# EAGLE design Calc13Digit034 (EAGLE 7.7.0)
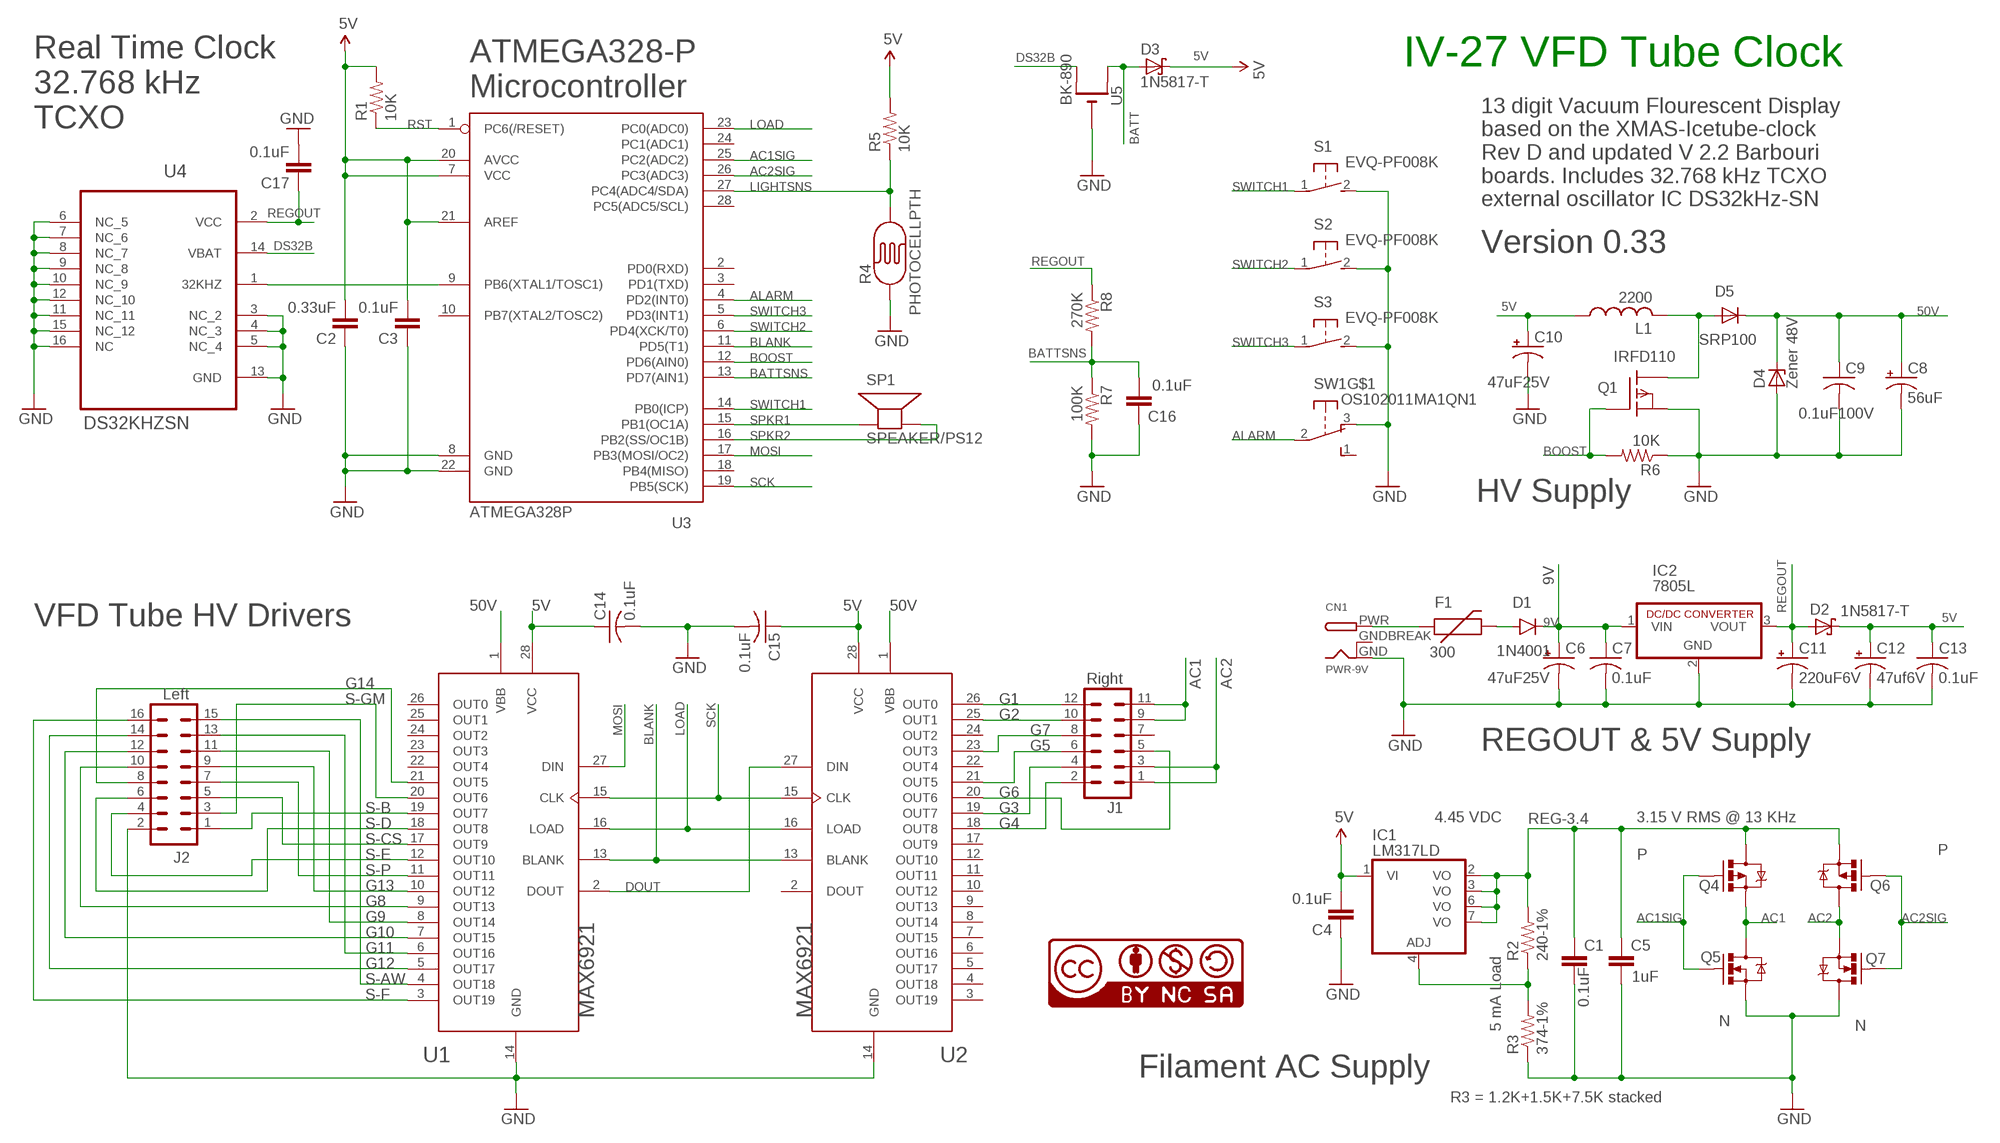
[diagram p0: schematic, sheet 1]

## Parts
C1  0.1uF  1.0UF-16V-10%(0603)  [0603-CAP]
C2  0.33uF  1.0UF-16V-10%(0603)  [0603-CAP]
C3  0.1uF  1.0UF-16V-10%(0603)  [0603-CAP]
C4  0.1uF  1.0UF-16V-10%(0603)  [0603-CAP]
C5  1uF  1.0UF-16V-10%(0603)  [0603-CAP]
C6  47uF25V  CPOL-USE2.5-7  [E2,5-7]
C7  0.1uF  C-USC0805  [C0805]
C8  56uF  CPOL-USE3.5-8  [E3,5-8]
C9  0.1uF100V  C-US025-024X044  [C025-024X044]
C10  47uF25V  CPOL-USE2.5-7  [E2,5-7]
C11  220uF6V  CPOL-USE2.5-7  [E2,5-7]
C12  47uf6V  CPOL-USE2.5-7  [E2,5-7]
C13  0.1uF  C-US025-024X044  [C025-024X044]
C14  0.1uF  C-US025-024X044  [C025-024X044]
C15  0.1uF  C-US025-024X044  [C025-024X044]
C16  0.1uF  1.0UF-16V-10%(0603)  [0603-CAP]
C17  0.1uF  1.0UF-16V-10%(0603)  [0603-CAP]
CN1  PWR-9V  DCBARRELPTH  [DCJACK_2MM_PTH]
D1  1N4001  DIODEPTH  [DIODE-1N4001]
D2  1N5817-T  [DO41-7.6]
D3  1N5817-T  [DO41-7.6]
D4  Zener 48V  ZENER-DIODEZD-10  [ZDIO-10]
D5  SRP100  [DO41-10]
F1  300  PTCPTH  [PTC]
IC1  LM317LD  [SO08]
IC2  7805L  R-78C5.0-1.0  [SIP3]
J1  Right  M06X2PTH_FEMALE  [2X6]
J2  Left  M08X2  [2X8]
L1  2200  L  [6000]
Q1  IRFD110  IRFD9210  [DIL04]
Q4  P  MOSFET-PCHANNEL  [SOT23-3]
Q5  N  MOSFET-NCHANNELBSS123LT1G  [SOT23-3]
Q6  P  MOSFET-PCHANNEL  [SOT23-3]
Q7  N  MOSFET-NCHANNELBSS123LT1G  [SOT23-3]
R1  10K  10KOHM-1/10W-1%(0603)0603  [0603-RES]
R2  240-1%  0.3OHM-1/8W-1%(0805)  [0805]
R3  374-1%  0.3OHM-1/8W-1%(0805)  [0805]
R4  PHOTOCELLPTH  [PHOTOCELL]
R5  10K  10KOHM-1/10W-1%(0603)0603  [0603-RES]
R6  10K  10KOHM-1/10W-1%(0603)0603  [0603-RES]
R7  100K  10KOHM-1/10W-1%(0603)0603  [0603-RES]
R8  270K  10KOHM-1/10W-1%(0603)0603  [0603-RES]
S1  EVQ-PF008K  31-XX  [B3F-31XX]
S2  EVQ-PF008K  31-XX  [B3F-31XX]
S3  EVQ-PF008K  31-XX  [B3F-31XX]
SP1  SPEAKER/PS12  [PS12]
SW1  OS102011MA1QN1  OS102011MA1Q  [OS102011MA1Q]
U1  MAX6921  [PLCC-S28]
U2  MAX6921  [PLCC-S28]
U3  ATMEGA328P  ATMEGA328P_PDIP  [DIL28-3]
U4  DS32KHZSN  [SOIC127P1034X267-16N]
U5  BK-890  CR1220THM  [CR1220-THM]
U$2  CC-NC-BCSMALL  [CC-NC-BY_SMALL]

## Nets
5V: C2.2 C3.2 C4.2 C10.+ C12.+ C13.1 C14.1 C15.1 D2.C D3.C IC1.1(VI) L1.1 R1.2 R5.2 U1.28(VCC) U2.28(VCC) U3.7(VCC) U3.20(AVCC) U3.21(AREF)
9V: C6.+ C7.1 D1.C IC2.1(VIN)
32KHZ: U3.9(PB6(XTAL1/TOSC1)) U4.1(32KHZ)
50V: C8.+ C9.1 D4.C D5.C U1.1(VBB) U2.1(VBB)
AC1: J1.9 J1.11 Q4.2(S) Q5.3(D)
AC1SIG: Q4.1(G) Q5.1(G) U3.25(PC2(ADC2))
AC2: J1.1 J1.3 Q6.3(D) Q7.2(S)
AC2SIG: Q6.1(G) Q7.1(G) U3.26(PC3(ADC3))
ALARM: SW1.2(P) U3.4(PD2(INT0))
BATT: D3.A U5.+1(+)
BATTSNS: C16.2 R7.1 R8.2 U3.13(PD7(AIN1))
BLANK: U1.13(BLANK) U2.13(BLANK) U3.11(PD5(T1))
BOOST: Q1.1(G) R6.2 U3.12(PD6(AIN0))
DOUT: U1.2(DOUT) U2.27(DIN)
DS32B: U4.14(VBAT) U5.+2(+1)
F9V: D1.A F1.P$2
G1: J1.12 U2.26(OUT0)
G2: J1.10 U2.25(OUT1)
G3: J1.4 U2.19(OUT7)
G4: J1.2 U2.18(OUT8)
G5: J1.6 U2.21(OUT5)
G6: J1.5 U2.20(OUT6)
G7: J1.8 U2.23(OUT3)
G8: J2.10 U1.9(OUT13)
G9: J2.11 U1.8(OUT14)
G10: J2.12 U1.7(OUT15)
G11: J2.13 U1.6(OUT16)
G12: J2.14 U1.5(OUT17)
G13: J2.9 U1.10(OUT12)
G14: J2.8 U1.21(OUT5)
GND: C1.1 C2.1 C3.1 C4.1 C5.1 C6.- C7.2 C8.- C9.2 C10.- C11.- C12.- C13.2 C14.2 C15.2 C16.1 C17.2 CN1.GND D4.A IC2.2(GND) J2.2 Q1.2(S) Q5.2(S) Q7.3(D) R3.1 R4.1 R6.1 R7.2 S1.2(S) S2.2(S) S3.2(S) SW1.3(O) U1.14(GND) U2.14(GND) U3.8(GND) U3.22(GND) U4.3(NC_2) U4.4(NC_3) U4.5(NC_4) U4.6(NC_5) U4.7(NC_6) U4.8(NC_7) U4.9(NC_8) U4.10(NC_9) U4.11(NC_11) U4.12(NC_10) U4.13(GND) U4.15(NC_12) U4.16(NC) U5.-
LIGHTSNS: R4.2 R5.1 U3.27(PC4(ADC4/SDA))
LOAD: U1.16(LOAD) U2.16(LOAD) U3.23(PC0(ADC0))
MOSI: U1.27(DIN) U3.17(PB3(MOSI/OC2))
N$25: D5.A L1.2 Q1.3(D) Q1.4(D)
N$28: IC1.4(ADJ) R2.1 R3.2
PWR: CN1.PWR F1.P$1
REG-3.4: C1.2 C5.2 IC1.2(VO) IC1.3(VO) IC1.6(VO) IC1.7(VO) Q4.3(D) Q6.2(S) R2.2
REGOUT: C11.+ C17.1 D2.A IC2.3(VOUT) R8.1 U4.2(VCC)
RST: R1.1 U3.1(PC6(/RESET))
S-AW: J2.15 U1.4(OUT18)
S-B: J2.1 U1.19(OUT7)
S-CS: J2.5 U1.17(OUT9)
S-D: J2.6 U1.18(OUT8)
S-E: J2.4 U1.12(OUT10)
S-F: J2.16 U1.3(OUT19)
S-GM: J2.3 U1.20(OUT6)
S-P: J2.7 U1.11(OUT11)
SCK: U1.15(CLK) U2.15(CLK) U3.19(PB5(SCK))
SPKR1: SP1.P$1(+) U3.15(PB1(OC1A))
SPKR2: SP1.P$2(-) U3.16(PB2(SS/OC1B))
SWITCH1: S1.1(P) U3.14(PB0(ICP))
SWITCH2: S2.1(P) U3.6(PD4(XCK/T0))
SWITCH3: S3.1(P) U3.5(PD3(INT1))
Unconnected: J1.7 SW1.1(S) SW1.MT1(MT) SW1.MT2(MT) U1.22(OUT4) U1.23(OUT3) U1.24(OUT2) U1.25(OUT1) U1.26(OUT0) U2.2(DOUT) U2.3(OUT19) U2.4(OUT18) U2.5(OUT17) U2.6(OUT16) U2.7(OUT15) U2.8(OUT14) U2.9(OUT13) U2.10(OUT12) U2.11(OUT11) U2.12(OUT10) U2.17(OUT9) U2.22(OUT4) U2.24(OUT2) U3.2(PD0(RXD)) U3.3(PD1(TXD)) U3.10(PB7(XTAL2/TOSC2)) U3.18(PB4(MISO)) U3.24(PC1(ADC1)) U3.28(PC5(ADC5/SCL))

## Notes on the sheet
- IV-27 VFD Tube Clock
- ATMEGA328-P
  Microcontroller
- 13 digit Vacuum Flourescent Display
  based on the XMAS-Icetube-clock
  Rev D and updated V 2.2 Barbouri
  boards. Includes 32.768 kHz TCXO
  external oscillator IC DS32kHz-SN
- Real Time Clock
  32.768 kHz
  TCXO
- Version 0.33
- HV Supply
- VFD Tube HV Drivers
- REGOUT & 5V Supply
- 4.45 VDC | 3.15 V RMS @ 13 KHz
- 5 mA Load
- Filament AC Supply
- R3 = 1.2K+1.5K+7.5K stacked

## Power pins joined to a net without a drawn wire
GNDBREAK: CN1.GNDBREAK

## Library data of the parts
C1-C5 C16 C17 = SparkFun-Capacitors:1.0UF-16V-10%(0603): CAP-00868; PROD_ID: CAP-00868; VALUE: 1.0uF
C6 C8 C10-C12 = resistor:CPOL-US: POLARIZED CAPACITOR, American symbol
C7 C9 C13-C15 = resistor:C-US: CAPACITOR, American symbol
CN1 = adafruit:DCBARREL: 2.0mm DC Barrel Jack DCJACK_2MM_PTH - Through Hole Jack (4UConnector: 05537)
D1 = SparkFun-DiscreteSemi:DIODE: Diode These are standard reverse protection diodes and small signal diodes. SMA package can handle up to about 1A. SOD-323 can handle about 200mA. What the SOD-323 package when ordering, there are some mfgs out there that are 5-pin packages.
D2 D3 = diode:1N581*: 1.0A SCHOTTKY BARRIER RECTIFIER Source: http://www.diodes.com/datasheets/ds23001.pdf
D4 = diode:ZENER-DIODE: Z-Diode
D5 = diode:SRP100: DIODE
F1 = SparkFun-PowerIC:PTC: Resettable Fuse PTC Resettable Fuse. Spark Fun Electronics SKU : COM-08357
IC1 = linear:LM317LD: LOW CURRENT 1.2 TO 37V ADJUSTABLE VOLTAGE REGULATOR Source: http://pdf.alldatasheet.com
IC2 = dc-dc-converter:R-78C*-1.0: INNOLINE DC/DC-Converter 1.0 AMP SIP3 Single Output Source: Data sheet <http://www.mikrocontroller.net/attachment/150645/157764-da-01-en-DC_DC_WANDLER_R_78C5_0_1_0.pdf>
J1 = SparkFun-Connectors:M06X2; PROD_ID: CONN-12423; VALUE: 2X6 FEMALE
J2 = SparkFun-Connectors:M08X2: .1" headers, two rows of 8 each
L1 = adafruit:L
Q1 = transistor-fet:IRFD9210: P-Channel Enhancement MOSFET
Q4 Q6 = SparkFun-DiscreteSemi:MOSFET-PCHANNEL: Generic PMOSFET IRLML2244 - TRANS-11153 (SOT-23 -20V -4.3A) (1.Gate 2.Source 3.Drain) FQP27P06 - COM-10349 <http://www.sparkfun.com/products/10349> (TO-220 -60V -27A) (1.Gate 2.Source 3.Drain); PROD_ID: TRANS-08285
Q5 Q7 = SparkFun-DiscreteSemi:MOSFET-NCHANNEL: Common NMOSFET Parts MFG P/N Store ID Prod ID FDD8780 TRANS-09984 SI7820DN TRANS-11055 FDS6630A IC-08089 2N7002PW TRANS-11151 FQP30N06L COM-10213 TRANS-10060 BSS123LT1G TRANS-08345 BSS138 TRANS-00830 BS170 2N7000; PROD_ID: TRANS-08345
R1 R5 R6 = SparkFun-Resistors:10KOHM-1/10W-1%(0603): RES-00824; PROD_ID: RES-00824
R2 R3 = SparkFun-Resistors:0.3OHM-1/8W-1%(0805): RES-11622; PROD_ID: RES-11622; VALUE: 0.3
R4 = SparkFun-Sensors:PHOTOCELL: CdS photoresistor. This is a low cost way to detect light levels. Resistance decreases with more incoming light. SparkFun SKU: SEN-09088
R7 R8 = SparkFun-Resistors:10KOHM-1/10W-1%(0603): RES-00824; PROD_ID: RES-00824; VALUE: 10K
S1-S3 = switch-omron:31-XX: OMRON SWITCH; MPN: B3F-3100; OC_FARNELL: 959704; OC_NEWARK: 36M3582
SP1 = adafruit:SPEAKER: SPEAKER Source: Buerklin Added PS12 (for part # PS1240 piezo) http://www.ladyada.net/library/pcb/eaglelibrary.html
SW1 = adafruit:OS102011MA1Q: OS10201MA1Q through-hole right angle switch http://www.ladyada.net/library/eagle
U1 U2 = Caddock:MAX6921: MAX6921 76V VFD driver in TSSOP and PLCC. Can be cascaded, talk to it via SPI
U3 = SparkFun-DigitalIC:ATMEGA328P_PDIP: uC used in the Arduino 32kb flash, 1k EEPROM, 2k SRAM This is the through-hole version of this chip.
U4 = Maxim_By_element14_Batch_1:DS32KHZSN: 32.768kHz Temperature-Compensated Crystal Oscillator; MPN: DS32KHZSN#; OC_FARNELL: -; OC_NEWARK: 68K3402; PACKAGE: SOIC-16; SUPPLIER: Maxim
U5 = adafruit:CR1220: CR1216/CR1220/CR1225 12mm 3V lithium coin cell Great for battery packup. Both SMT and THM holders. Note the THM package has the ground pads on both sides of the PCB so that the masks are the same - this reduces the cost
U$2 = cc-by-nc-sa:CC-NC-BC: All hardware is licensed under the Creative Commons Attribution-Noncommercial-Share Alike 2.5 Switzerland License. To view a copy of this license, visit http://creativecommons.org/licenses/by-nc-sa/2.5/ch/ or send a letter to Creative Commons, 171 Second Street, Suite 300, San Francisco, California, 94105, USA.

## Board
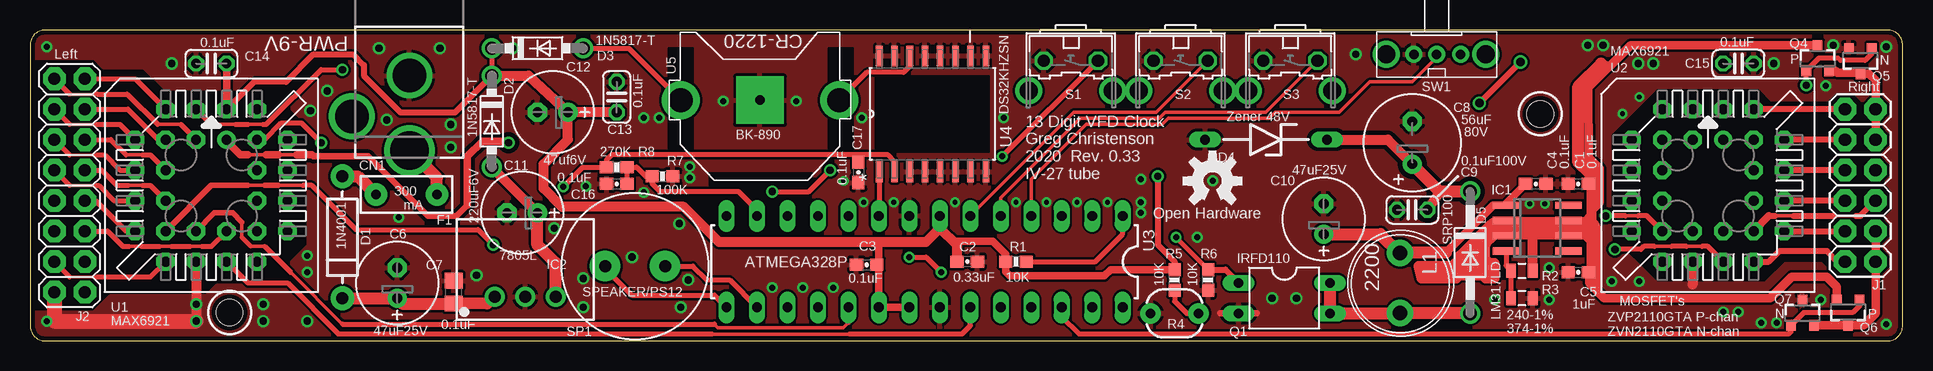
[diagram p1: board, top side]
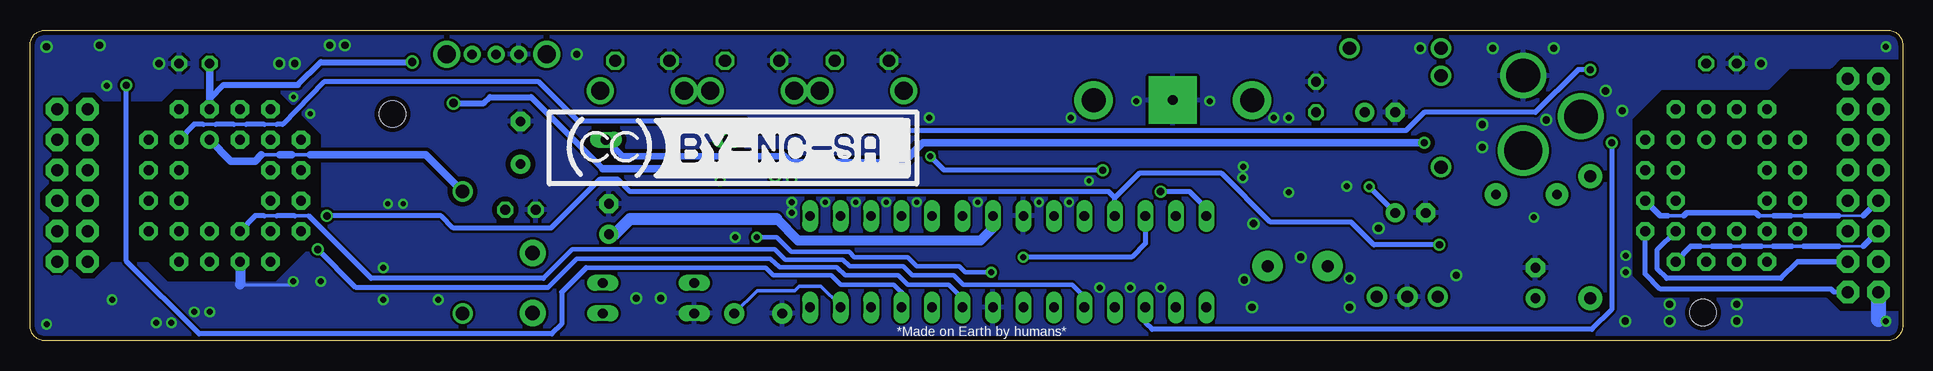
[diagram p2: board, bottom side, seen from below]

Size 156.06 x 25.91 mm. Coordinates in mm from the lower left corner, seen from the top.
Outline: 1.27,0 154.79,0 arc90 156.06,1.27 156.06,24.64 arc90 154.79,25.91 1.27,25.91 arc90 0,24.64 0,1.27 arc90 1.27,0
Copper layers (1*16): Top 0.035mm / dielectric 1.5mm / Bottom 0.035mm
Design rules "default *": minimum track width 8mil, minimum drill 9mil, track to track 8mil, track to pad 8mil, pad to pad 8mil, via to via 8mil, smd to smd 6mil, copper to edge 15mil, drill to drill 9mil, minimum pad ring 10mil, minimum via ring 8mil, stop-mask expansion 4mil, vias tented up to drill 24mil, thermal gap 10mil
Holes 2.2 mm at 125.86,18.92 16.64,2.36
tRestrict: area 70.5,15.7 to 79.9,22; area 119.6,12.1 to 120.4,12.8; area 116.2,10.7 to 116.7,11.2; area 114.8,14.4 to 115.6,15.1; area 39.2,15.9 to 40.5,17.1; 15 lines
bRestrict: area 119.6,12.1 to 120.4,12.8; area 116.2,10.7 to 116.7,11.2; area 114.8,14.3 to 115.6,15.1; area 39.2,15.9 to 40.5,17.1; 10 lines

### Footprints (pad centres in the part's own frame; a part is rotated, then mirrored left to right if it is on the bottom)
0603-CAP = smd 1.1 x 1: 1 -0.85,0; 2 0.85,0
E2,5-7 = drill 0.813 pad 1.6: + -1.27,0 | drill 0.813 pad 1.6 octagon: - 1.27,0
C0805 = smd 1.3 x 1.5: 1 -0.95,0; 2 0.95,0
E3,5-8 = drill 0.813 pad 1.6: + -1.778,0 | drill 0.813 pad 1.6 octagon: - 1.778,0
C025-024X044 = drill 0.813 octagon: 1 -1.27,0; 2 1.27,0
DCJACK_2MM_PTH = drill 2.8: GND 0,7.35; GNDBREAK 4.8,10.75 | drill 3.2: PWR 0,13.6
DIODE-1N4001 = drill 1 pad 1.981: A -5.08,0; C 5.08,0
DO41-7.6 = drill 1.1 pad 1.7: A 3.81,0; C -3.81,0
ZDIO-10 = drill 0.813 long: A 5.08,0; C -5.08,0
DO41-10 = drill 1.118: A 5.08,0; C -5.08,0
PTC = drill 0.8 pad 1.88: P$1 -2.54,0; P$2 2.54,0
SO08 = smd 0.6 x 2.2: 1 -1.905,-2.6; 2 -0.635,-2.6; 3 0.635,-2.6; 4 1.905,-2.6; 5 1.905,2.6; 6 0.635,2.6; 7 -0.635,2.6; 8 -1.905,2.6
SIP3 = drill 1 pad 1.676: 1 -2.54,0; 2 0,0; 3 2.54,0
2X6 = drill 1.016 pad 1.88 octagon: 1 0,0; 2 0,2.54; 3 2.54,0; 4 2.54,2.54; 5 5.08,0; 6 5.08,2.54; 7 7.62,0; 8 7.62,2.54; 9 10.16,0; 10 10.16,2.54; 11 12.7,0; 12 12.7,2.54
2X8 = drill 1.016 pad 1.88 octagon: 1 0,0; 2 0,2.54; 3 2.54,0; 4 2.54,2.54; 5 5.08,0; 6 5.08,2.54; 7 7.62,0; 8 7.62,2.54; 9 10.16,0; 10 10.16,2.54; 11 12.7,0; 12 12.7,2.54; 13 15.24,0; 14 15.24,2.54; 15 17.78,0; 16 17.78,2.54
6000 = drill 1.2 pad 2.184: 1 -2.5,0; 2 2.5,0
DIL04 = drill 0.813 long: 1 -1.27,-3.81; 2 1.27,-3.81; 3 1.27,3.81; 4 -1.27,3.81
SOT23-3 = smd 0.8 x 0.9: 1 -0.95,-1; 2 0.95,-1; 3 0,1.1
0603-RES = smd 1.1 x 1: 1 -0.85,0; 2 0.85,0
0805 = smd 0.8 x 1.2: 1 -0.9,0; 2 0.9,0
PHOTOCELL = drill 0.8 pad 1.676: 1 -2,0; 2 2,0
B3F-31XX = drill 1.016 octagon: 1 -2.261,-1.245; 2 2.261,-1.245 | drill 1.499 pad 2.159: 3 -3.505,1.245; 4 3.505,1.245
PS12 = drill 1 pad 2.54: P$1 -2.5,0; P$2 2.5,0
OS102011MA1Q = drill 0.8 pad 1.422: 1 -2,0; 2 0,0; 3 1.9,0 | drill 1.5 pad 2.184: MT1 -4.1,0; MT2 4.2,0
PLCC-S28 = drill 0.813 pad 1.524: 1 1.27,3.81 | drill 0.813 pad 1.524 octagon: 2 -1.27,6.35; 3 -1.27,3.81; 4 -3.81,6.35; 5 -6.35,3.81; 6 -3.81,3.81; 7 -6.35,1.27; 8 -3.81,1.27; 9 -6.35,-1.27; 10 -3.81,-1.27; 11 -6.35,-3.81; 12 -3.81,-6.35; 13 -3.81,-3.81; 14 -1.27,-6.35; 15 -1.27,-3.81; 16 1.27,-6.35; 17 1.27,-3.81; 18 3.81,-6.35; 19 6.35,-3.81; 20 3.81,-3.81; 21 6.35,-1.27; 22 3.81,-1.27; 23 6.35,1.27; 24 3.81,1.27; 25 6.35,3.81; 26 3.81,6.35; 27 3.81,3.81; 28 1.27,6.35
DIL28-3 = drill 0.813 long: 1 -16.51,-3.81; 2 -13.97,-3.81; 3 -11.43,-3.81; 4 -8.89,-3.81; 5 -6.35,-3.81; 6 -3.81,-3.81; 7 -1.27,-3.81; 8 1.27,-3.81; 9 3.81,-3.81; 10 6.35,-3.81; 11 8.89,-3.81; 12 11.43,-3.81; 13 13.97,-3.81; 14 16.51,-3.81; 15 16.51,3.81; 16 13.97,3.81; 17 11.43,3.81; 18 8.89,3.81; 19 6.35,3.81; 20 3.81,3.81; 21 1.27,3.81; 22 -1.27,3.81; 23 -3.81,3.81; 24 -6.35,3.81; 25 -8.89,3.81; 26 -11.43,3.81; 27 -13.97,3.81; 28 -16.51,3.81
SOIC127P1034X267-16N = smd 1.727 x 0.559: 1 -4.826,4.445; 2 -4.826,3.175; 3 -4.826,1.905; 4 -4.826,0.635; 5 -4.826,-0.635; 6 -4.826,-1.905; 7 -4.826,-3.175; 8 -4.826,-4.445; 9 4.826,-4.445; 10 4.826,-3.175; 11 4.826,-1.905; 12 4.826,-0.635; 13 4.826,0.635; 14 4.826,1.905; 15 4.826,3.175; 16 4.826,4.445
CR1220-THM = drill 2 pad 3.175: +1 -6.604,0; +2 6.604,0 | drill 0.8 pad 3.962 square: - 0,0

### Placement (x,y rotation side)
C1  129.03,13.08 0 top
C2  78.11,6.6 180 top
C3  69.72,6.35 0 top
C4  125.48,13.08 180 top
C5  129.03,5.71 0 top
C6  30.61,4.83 90 top
C7  35.31,4.06 90 top
C8  115.19,16.51 90 top
C9  115.19,10.92 180 top
C10  107.82,10.16 90 top
C11  41.02,10.67 180 top
C12  43.56,19.05 180 top
C13  48.9,20.32 90 top
C14  15.11,23.11 180 top
C15  142.37,23.11 0 top
C16  48.9,13.08 0 top
C17  69.04,14.05 270 top
CN1  31.62,29.46 180 top
D1  26.04,8.64 270 top
D2  38.48,18.29 270 top
D3  42.29,24.38 0 top
D4  103,16.76 180 top
D5  120.02,7.37 270 top
F1  31.37,12.19 180 top
IC1  125.6,9.4 270 top
IC2  41.27,3.68 0 top
J1  153.8,6.6 90 top
J2  4.57,4.06 90 top
L1  114.17,4.83 270 top
Q1  104.52,3.56 270 top
Q4  148.97,23.52 0 top
Q5  152.53,23.37 180 top
Q6  151.51,2.41 180 top
Q7  147.7,2.31 0 top
R1  82.17,6.6 180 top
R2  124.33,5.84 0 top
R3  124.33,3.56 180 top
R4  95.38,2.29 0 top
R5  95.38,5.08 90 top
R6  98.17,5.08 90 top
R7  52.7,13.72 0 top
R8  48.9,14.48 0 top
S1  86.74,22.1 180 top
S2  95.89,22.1 180 top
S3  105.03,22.1 180 top
SP1  50.42,6.22 0 top
SW1  117.22,23.88 180 top
U1  15.11,12.95 0 top
U2  139.83,12.95 0 top
U3  74.55,6.6 180 top
U4  75.21,18.92 90 top
U5  60.83,20.07 0 top
U$1  [OSHW-LOGO-M]  98.55,13.34 0 top
U$2  112.78,13.08 0 bottom

### Tracks (layer width: path | path; a pad name or v marks a point on that pad's centre or on a via)
5V  (via drill 0.6, 0.7)
  Top 0.305: 121.92,11.3 IC1.1
  Top 0.406: D3.C D2.C | 76.99,8.31 77.25,7.96 | 95.36,5.92 R5.2
  Top 0.508: D2.C 35.43,19.05 30.86,19.05 27.81,22.1 27.81,22.99 26.92,23.88 23.62,23.88 21.34,21.59 18.67,21.59 U1.28 | v124.21,23.24 v120.78,19.81 | v93.98,13.72 93.98,8 95.38,6.6 R5.2
  Top 0.61: 70.74,6.01 U3.20 U3.21 | 70.74,6.01 C3.2 | 70.74,6.01 70.74,8.23 | 76.99,8.31 80.21,8.31 81.32,7.2 R1.2 81.32,5.75 81.66,5.41 89.53,5.41 90.04,5.92 95.36,5.92 | C14.1 U1.28 | IC1.1 123,11.43 C4.2
  Top 0.686: 121.92,11.3 117.98,7.37
  Top 0.813: U3.7 75.82,9.4 | 75.82,9.4 74.65,8.23 70.74,8.23 57.43,8.23 54.48,11.18 44.32,11.18 42.8,12.7 42.8,14.73 44.83,16.76 C12.+ | D2.C 41.53,22.1 C12.+ | C13.1 C12.+ | C2.2 77.25,7.96 75.82,9.4 | 114.16,7.32 L1.1 114.21,7.37
  Top 1.016: C10.+ 112.52,8.89 114.16,7.32 | 117.98,7.37 114.21,7.37
  Bottom 0.508: v124.21,23.24 131.83,23.24 133.73,21.34 139.95,21.34 141.1,20.19 U2.28 | v120.78,19.81 118.24,19.81 117.73,20.32 114.3,20.32 108.33,14.35
  Bottom 0.61: 108.33,14.35 94.61,14.35 v93.98,13.72 | C15.1 U2.28
  Bottom 0.813: C10.+ 107.31,8.89 | 93.85,10.16 92.08,8.38 76.83,8.38 75.82,9.4 U3.7
  Bottom 1.016: 107.31,8.89 106.05,10.16 93.85,10.16
9V
  Top 1.016: D1.C C6.+ 31.01,3.1 C7.1 38.08,3.12 IC2.1
32KHZ
  Top 0.406: U4.1 70.76,10.44 U3.9
50V  (via drill 0.6)
  Top 0.305: 18.16,15.49 19.68,15.49 | 20.7,15.49 22.23,15.49
  Top 0.508: 28.19,15.37 33.15,10.41 35.56,10.41 36.45,11.3
  Top 0.559: 23.5,15.49 23.62,15.37 28.19,15.37
  Top 0.61: U1.1 16.38,16.64 17.53,15.49 18.16,15.49 | 19.68,15.49 20.7,15.49 | 22.23,15.49 23.5,15.49 | 36.45,11.3 36.45,15.37 37.72,16.64 39.75,16.64 v39.88,16.51
  Top 0.813: 117.47,12.45 C9.1 | D4.C 113.16,16.76 C8.+
  Top 1.016: D5.C 117.47,12.45 C8.+
  Bottom 0.305: 136.78,15.49 135.25,15.49 | 134.24,15.49 132.72,15.49
  Bottom 0.559: 93.22,15.37 106.68,15.37 D4.C
  Bottom 0.61: U2.1 139.32,14.99 137.29,14.99 136.78,15.49 | 135.25,15.49 134.24,15.49 | 132.72,15.49 123.06,15.49 D5.C | v39.88,16.51 81.66,16.51 83.31,14.86 92.71,14.86 93.22,15.37
AC1
  Top 0.711: J1.9 J1.11 153.8,21.72 153.25,22.27 Q5.3 152.5,22.34 150.62,22.35 150.45,22.52 Q4.2
AC1SIG  (via drill 0.6)
  Top 0.406: Q5.1 153.48,23.91 152.93,23.37 150.88,23.37 150.67,23.57 149.07,23.57 Q4.1 148.03,22.51 v148.03,21.31
  Bottom 0.356: 83.44,4.06 84.07,4.7 88.52,4.7 89.28,5.46 94.11,5.46 94.74,6.1 109.73,6.1
  Bottom 0.406: U3.25 83.44,4.06 | 109.73,6.1 111.76,4.06 111.76,1.4 112.57,0.58 141.96,0.58 148.03,6.66 v148.03,21.31
AC2
  Top 0.711: J1.3 J1.1 153.8,2.29 152.82,1.31 Q6.3 151.76,1.31 Q7.2
AC2SIG
  Top 0.406: Q6.1 152.46,2.93 151.89,2.36 147.8,2.36 Q7.1 146.76,1.25 146.74,0.76 146.56,0.58 87.43,0.58 85.98,2.03 U3.26
ALARM
  Top 0.305: SW1.2 117.22,23.62 115.19,21.59 111.63,21.59 109.09,19.05 103.76,19.05 103.25,18.54 94.87,18.54 94.36,18.03 88.01,18.03 83.44,13.46 U3.4
BATT
  Top 0.406: D3.A 49.91,24.38 U5.+1
BATTSNS
  Top 0.406: U3.13 60.58,10.92 59.05,12.45 52.5,12.45 51.87,13.08 51.87,13.7 R7.1 51.31,13.72 50.55,14.48 R8.2 C16.2
BLANK  (via drill 0.6)
  Top 0.305: 133.99,10.41 132.97,10.41 | 22.73,12.95 20.7,12.95 | 19.56,12.95 18.16,12.95
  Top 0.406: U2.13 134.75,10.41 133.99,10.41 | 132.97,10.41 v131.32,10.41 | 22.73,12.95 23.5,12.95 27.18,9.27 37.34,9.27 v38.61,8
  Top 0.457: 20.7,12.95 19.56,12.95 | 18.16,12.95 15.11,12.95 U1.13
  Bottom 0.406: v38.61,8 44.07,8 45.97,9.91 52.7,9.91 56.77,13.97 63.63,13.97 65.66,11.94 | U3.11 65.66,11.94 | 65.66,11.94 66.17,12.45 106.05,12.45 107.06,13.46 108.58,13.46 112.65,9.4 120.78,9.4 121.79,10.41 v131.32,10.41
BOOST  (via drill 0.5)
  Top 0.356: v95.5,8.64 95.89,8.22 R6.2
  Top 0.406: v73.28,6.99 74.68,6.99 v75.95,5.71
  Top 0.508: R6.2 99.61,5.93 Q1.1
  Bottom 0.356: v75.95,5.71 78.11,5.71 78.61,6.22 82.17,6.22 82.93,6.99 87.38,6.99 87.81,7.42 92.63,7.42 93.85,8.64 v95.5,8.64
  Bottom 0.406: U3.12 63.12,8.13 64.26,6.99 v73.28,6.99
DOUT  (via drill 0.6)
  Top 0.305: 15.62,18.03 17.14,18.03 | 18.16,18.03 19.43,18.03
  Top 0.406: U1.2 15.11,18.03 15.62,18.03 | 17.14,18.03 18.16,18.03 | 19.43,18.03 19.68,18.03 24.26,22.61 v26.04,22.61
  Bottom 0.305: 135.51,18.03 136.53,18.03 | 138.05,18.03 139.06,18.03 | 140.59,18.03 141.6,18.03
  Bottom 0.406: v26.04,22.61 27.05,22.61 30.61,19.05 39.88,19.05 41.4,17.53 95.63,17.53 96.39,18.29 110.36,18.29 113.67,21.59 131.57,21.59 135,18.03 135.51,18.03 | 136.53,18.03 138.05,18.03 | 139.06,18.03 140.59,18.03 | 141.6,18.03 142.37,18.03
  Bottom 0.457: 142.37,18.03 U2.27
DS32B
  Top 0.406: U4.14 73.3,22.89 72.8,22.38 69.75,22.38 U5.+2
F9V
  Top 1.016: D1.A 27.3,13.72 F1.P$2
G1
  Top 0.508: J1.12 U2.26
G2
  Top 0.508: J1.10 U2.25
G3
  Top 0.508: U2.19 J1.4
G4
  Top 0.508: U2.18 144.91,6.6 145.8,7.49 149.73,7.49 150.62,6.6 J1.2
G5
  Top 0.508: J1.6 U2.21
G6
  Top 0.254: 150.37,10.41 152.15,10.41
  Top 0.305: 145.41,10.41 146.94,10.41
  Top 0.508: 144.91,10.41 145.41,10.41 | 146.94,10.41 150.37,10.41 | 152.15,10.41 152.53,10.41 J1.5
  Top 0.61: U2.20 144.91,10.41
G7
  Top 0.508: J1.8 U2.23
G8
  Top 0.254: 3.3,12.95 5.59,12.95
  Top 0.406: J2.10 3.3,12.95 | 5.59,12.95 5.71,12.95 6.99,11.68 U1.9
G9
  Top 0.305: 8,15.49 9.37,15.49
  Top 0.406: J2.11 6.73,16.76 8,15.49 | 9.37,15.49 10.03,15.49 U1.8
G10
  Top 0.254: 3.3,15.49 5.59,15.49
  Top 0.406: J2.12 3.3,15.49 | 5.59,15.49 6.22,15.49 7.49,14.22 U1.7
G11
  Top 0.406: J2.13 8.15,19.3 10.69,16.76 U1.6
G12
  Top 0.254: 3.3,18.03 5.59,18.03
  Top 0.406: J2.14 3.3,18.03 | 5.59,18.03 7.49,18.03 U1.5
G13
  Top 0.305: 8.15,12.95 9.37,12.95
  Top 0.406: J2.9 5.97,14.22 7.24,12.95 8.15,12.95 | 9.37,12.95 10.03,12.95 U1.10
G14
  Bottom 0.229: 3.3,10.41 5.33,10.41
  Bottom 0.305: 8.15,10.41 9.35,10.41 | 10.74,10.41 11.99,10.41 | 18.24,10.41 19.58,10.41
  Bottom 0.457: J2.8 3.3,10.41 | 5.33,10.41 8.15,10.41 | 9.35,10.41 10.74,10.41 | 11.99,10.41 12.24,10.67 17.98,10.67 18.24,10.41 | 19.58,10.41 20.19,10.41 U1.21
GND  (via drill 0.4, 0.5, 0.6)
  Top 0.559: 99.19,2.29 102.23,2.29
  Top 0.813: U1.14 v13.84,1.65 | U2.14 138.56,4.7
  Top 1.27: J2.2 2.03,1.65 v13.84,1.65
  Bottom 0.254: 138.56,4.7 134.11,4.7 v134.11,4.95
  Bottom 0.813: U2.14 138.56,4.7
  Bottom 1.27: J2.2 2.03,1.78
  other vias: 1.4,1.65 34.16,24.38 29.08,24.38 150.27,24.64 154.69,24.51 54.99,13.59 71.98,11.56 69.47,11.56 23.09,7.11 23.09,5.71 30.73,10.29 63.86,19.99 57.76,19.99 149.66,21.26 54.97,14.53 51.16,18.59 52.43,18.59 69.32,18.59 40.21,24.38 35.05,18.03 35.05,16.13 97.28,8.64 77.09,11.56 82.17,11.56 84.71,11.56 87.25,11.56 89.79,11.56 92.58,11.56 92.58,10.67 92.58,13.46 98.55,13.34 67.82,13.34 134.11,20.32 126.62,6.1 126.62,3.43 122.05,3.43 131.83,4.95 149.22,3.43 154.69,1.4 144.27,1.52 145.54,1.52 142.37,2.41 141.1,2.41 132.72,18.92 54.1,9.78 103.5,3.56 105.54,3.56 1.4,24.51 134.01,23.11 145.31,23.11 23.37,19.18 24.77,20.83 29.72,18.41 135.28,23.11 11.81,23.11 46.33,12.88 51.16,12.37 23.11,1.65 37.21,5.46 46.1,5.21 43.69,9.4 64.39,4.45 66.93,4.45 54.23,2.79 61.85,4.45 110.49,23.88 131.09,24.64 129.82,24.64 54.86,5.08 50.16,6.99 46.1,2.79 124.97,11.43 81.13,18.59 19.43,1.65 13.84,3.05 19.43,3.05 126.24,11.43
  pour Bottom: 0,0 156.08,0 156.08,25.91 0,25.91 0,23.62 5.33,23.62 6.1,22.86 9.53,22.86 11.3,21.08 20.19,21.08 22.73,18.54 22.73,5.33 20.83,3.43 6.48,3.43 5.33,2.29 0,2.29
  pour Top: 0,0 156.08,0 156.08,25.91 0,25.91 0,23.62 5.33,23.62 6.1,22.86 9.53,22.86 11.3,21.08 20.19,21.08 23.24,18.03 23.24,7.87 19.94,4.57 15.62,4.57 14.73,3.68 6.73,3.68 5.33,2.29 0,2.29
  cutout Top: 53.21,24.38 55.24,24.38 55.24,15.88 53.21,15.88
  cutout Top: 66.55,24.38 68.58,24.38 68.58,15.88 66.55,15.88
  cutout Top: 56.64,12.95 56.64,13.97 65.15,13.97 65.15,12.95
  cutout Top: 131.95,8.76 131.95,17.14 135.64,20.83 144.02,20.83 145.03,19.81 149.86,19.81 150.62,20.57 151.76,20.57 152.4,19.94 152.4,13.84 153.29,12.95 154.43,12.95 155.07,12.32 155.07,11.05 154.43,10.41 153.29,10.41 152.53,9.65 152.53,6.1 151.76,5.33 150.75,5.33 149.35,6.73 146.18,6.73 144.53,5.08 135.64,5.08
  cutout Bottom: 131.95,8.76 131.95,17.14 135.64,20.83 144.02,20.83 145.03,19.81 149.99,19.81 150.75,20.57 151.76,20.57 152.4,19.94 152.4,13.84 153.29,12.95 154.43,12.95 155.07,12.32 155.07,11.05 154.43,10.41 153.29,10.41 152.53,9.65 152.53,6.1 151.76,5.33 150.75,5.33 149.35,6.73 146.18,6.73 144.53,5.08 135.64,5.08
LIGHTSNS
  Top 0.406: R5.1 95.38,3.3 96.39,2.29 R4.2
  Bottom 0.305: U3.27 88.52,2.92 90.17,4.57 91.95,4.57 92.33,4.19 95.47,4.19 R4.2
LOAD  (via drill 0.6)
  Top 0.305: 139.32,7.87 138.05,7.87 | 136.78,7.87 135.38,7.87 | 56.82,0.58 56.87,0.53 68.35,0.53 68.3,0.58
  Top 0.356: 25.65,0.64 25.68,0.58
  Top 0.406: U2.16 139.83,7.87 139.32,7.87 | 138.05,7.87 136.78,7.87 | 135.38,7.87 134.49,7.87 134.24,7.62 v132.08,7.62 | U1.16 18.16,4.83 21.46,4.83 25.65,0.64 | 25.68,0.58 56.82,0.58 | 68.3,0.58 77.67,0.58 78.36,1.27 U3.23
  Bottom 0.305: U3.23 78.36,3.56
  Bottom 0.356: 78.36,3.56 79.5,4.7 82.93,4.7 83.69,5.46 88.14,5.46 88.82,6.15 93.6,6.15 94.36,6.86 110.49,6.86 112.9,4.45
  Bottom 0.406: 112.9,4.45 128.91,4.45 v132.08,7.62
MOSI  (via drill 0.6)
  Top 0.406: U1.27 19.56,16.76 20.95,18.16 22.61,18.16 v24.26,16.51
  Bottom 0.406: v24.26,16.51 24.26,2.62 25.91,0.96 62.56,0.96 63.12,1.52 U3.17
N$25
  Top 1.016: D5.A 119.59,2.33 L1.2 114.13,2.29 Q1.3 Q1.4
N$28
  Top 0.406: IC1.4 123,6.27 R2.1 R3.2
PWR
  Top 1.016: F1.P$1 33.91,13.58 CN1.PWR
REG-3.4
  Top 0.203: IC1.7 128.29,10.03 128.35,9.98
  Top 0.305: 122.17,9.4 122.17,9.14 122.05,9.02 | 121.16,8.26 121.28,8.26 | 121.16,8 121.28,8 | 129.92,9.4 129.92,9.53 130.05,9.65 130.3,9.4 130.43,9.4 | 130.81,11.56 130.81,11.68 130.68,11.81 | 130.68,13.97 129.92,13.97 | 129.88,15.15 129.92,15.11
  Top 0.406: 125.23,8.62 125.09,8.76
  Top 0.559: IC1.3 125.09,8.76 IC1.6 128.35,8.76 128.35,9.98 | IC1.2 IC1.7 | 130.02,12.89 C1.2
  Top 0.61: IC1.7 129.59,10.03 130.02,10.46 130.02,12.89 | 128.35,8.76 129.56,8.76 130.02,8.31 130.02,5.73 C5.2
  Top 0.711: Q6.2 150.56,4.51 149.73,5.33 146.81,5.33 145.03,3.56 131.19,3.56 129.92,4.83 129.92,5.68 C5.2 | Q4.3 148.32,24.62 148.34,24.64 133.38,24.65 129.87,21.13 129.88,15.15 C1.2
  Top 0.762: 130.68,14.35 130.81,14.35 130.81,11.56 130.18,10.92 130.18,9.78
  Top 0.813: R2.2 125.23,8.62 | 130.43,9.4 130.43,4.45 | 121.16,8.26 118.75,5.84 | 118.75,5.84 115.82,5.84 | 118.75,5.84 121.54,5.84 121.54,6.22 120.65,7.11 119.89,6.35 120.9,6.35 | 121.67,9.65 119.13,7.11 119.13,6.86 118.49,6.22 115.7,6.22 115.95,5.21 118.87,5.21 119.13,5.46 121.03,5.46 121.28,5.21 122.05,5.21 122.05,6.48 121.67,6.48 121.28,6.86 121.28,8 121.28,8.26 121.28,9.14 | 122.05,9.02 122.05,8.89 121.16,8 | 130.05,9.65 130.05,9.78
  Top 0.914: 130.18,9.78 130.05,9.78 | 130.68,14.35 129.92,15.11 | 129.92,13.97 129.03,14.86 | 130.68,11.81 130.68,13.97
  Top 0.991: 129.03,14.86 129.03,21.21 130.94,23.11 131.19,22.86
  Top 1.88: 129.92,9.4 122.17,9.4
REGOUT  (via drill 0.5)
  Top 0.203: 48.01,14.45 R8.1
  Top 0.406: U4.2 72.03,14.96 71.5,15.49 69.09,15.49 | 69.09,15.49 48.46,15.49 48.03,15.06 48.03,14.62 R8.1 | v44.45,12.85 46.05,14.45 48.01,14.45 | C17.1 69.09,15.49
  Top 0.813: D2.A C11.+
  Top 1.016: C11.+ 42.29,8 43.81,6.48 IC2.3
  Bottom 0.406: C11.+ 42.29,10.69 v44.45,12.85
RST
  Top 0.406: R1.1 88.77,6.6 91.06,8.89 U3.1
S-AW
  Top 0.406: J2.15 8.76,21.84 U1.4
S-B
  Bottom 0.406: J2.1 5.71,4.06 5.97,4.32 20.19,4.32 21.46,5.59 U1.19
S-CS
  Top 0.305: 8.26,7.87 9.27,7.87 | 10.79,7.87 11.81,7.87 | 13.34,7.87 14.35,7.87
  Top 0.406: J2.5 6.48,9.14 7.75,7.87 8.26,7.87 | U1.17 15.11,7.87 14.35,7.87 | 9.27,7.87 10.79,7.87 | 11.81,7.87 13.34,7.87
S-D
  Bottom 0.229: 3.3,7.87 5.33,7.87
  Bottom 0.305: 8.26,7.87 9.27,7.87 | 10.79,7.87 11.81,7.87 | 13.34,7.87 14.35,7.87 | 15.88,7.87 16.89,7.87
  Bottom 0.457: J2.6 3.3,7.87 | 5.33,7.87 8.26,7.87 | U1.18 17.65,7.87 16.89,7.87 | 9.27,7.87 10.79,7.87 | 11.81,7.87 13.34,7.87 | 14.35,7.87 15.88,7.87
S-E
  Top 0.254: 3.3,5.33 5.59,5.33
  Top 0.406: J2.4 3.3,5.33 | 5.59,5.33 10.03,5.33 U1.12
S-F
  Top 0.254: 3.3,20.57 5.59,20.57
  Top 0.305: 10.64,18.03 12.57,18.03
  Top 0.406: J2.16 3.3,20.57 | 5.59,20.57 8.1,20.57 10.64,18.03 | 12.57,18.03 U1.3
S-GM
  Bottom 0.406: 8.76,6.6 10.16,5.21 19.68,5.21 20.45,5.97 20.45,7.62 U1.20
  Bottom 0.457: J2.3 8.76,6.6
S-P
  Top 0.406: J2.7 5.46,11.68 8,9.14 U1.11
SCK
  Top 0.305: 17.65,9.91 17.65,8.64 | 18.41,7.87 19.56,7.87 | 21.72,5.71 26.04,1.4 | 57.02,1.4 57.33,1.09 67.77,1.09 68.2,1.52
  Top 0.356: 17.65,8.64 18.41,7.87
  Top 0.406: 19.56,7.87 21.72,5.71 | 26.04,1.4 57.02,1.4 | 68.2,1.52 U3.19
  Top 0.457: U1.15 15.37,10.67 16.89,10.67 17.65,9.91
  Bottom 0.305: 132.84,10.41 133.99,10.41 | 135.51,10.41 136.53,10.41
  Bottom 0.356: 68.2,3.68 69.22,4.7 78.31,4.7 79.07,5.46 82.55,5.46 83.31,6.22 87.76,6.22 88.32,6.78 93.14,6.78 93.98,7.62 110.87,7.62 113.28,5.21
  Bottom 0.406: U3.19 68.2,3.68 | 113.28,5.21 127.64,5.21 132.84,10.41 | 133.99,10.41 135.51,10.41 | 136.53,10.41 137.29,10.41
  Bottom 0.457: 137.29,10.41 U2.15
SPKR1
  Top 0.406: SP1.P$1 47.66,6.31 50.16,3.81 57.02,3.81 U3.15
SPKR2
  Top 0.406: SP1.P$2 55.24,6.22 56.39,5.08 58.29,5.08 U3.16
SWITCH1  (via drill 0.5, 0.6)
  Top 0.406: v61.85,12.45 64.9,12.45 v66.67,14.22 | v81.03,15.37 S1.1
  Bottom 0.406: U3.14 58.04,11.05 59.44,12.45 v61.85,12.45 | v81.03,15.37 79.88,14.22 v66.67,14.22
SWITCH2
  Top 0.305: S2.1 93.85,19.05 87,19.05 U3.6
SWITCH3
  Top 0.305: S3.1 103,19.05 94.61,19.05 94.11,18.54 87.5,18.54 80.9,11.94 U3.5

### Text on the board
tNames: CR-1220 | 80V | 13 Digit VFD Clock / Greg Christenson / 2020 Rev. 0.33 / IV-27 tube | mA | Open Hardware | MOSFET's | ZVP2110GTA P-chan / ZVN2110GTA N-chan
bNames: *Made on Earth by humans*
bStop: Greg Christenson / Barbouri 2020